# Altium schematic sheet FPGA_MISC.SchDoc: Phaser
size 420 x 297 mm; EDA_Number: ARTIQ; Projet: ARTIQ/SINARA; Author: G.Kasprowicz; CompanyName: WUT ISE; DrawnBy: G.Kasprowicz; Organization: WUT ISE; Address1: PW ISE; Address2: Nowowiejska 15/19 00-665 Warsaw; Address3: gkasprow@gmail.com; Revision: 2; SheetNumber: -; SheetTotal: -; ModifiedBy: -; CheckedDate: -; Title2: xxx; DivGrp: WUT ISE; Designer: G.Kasprowicz; ModifiedDate: -; ProjectName: Sensor Box
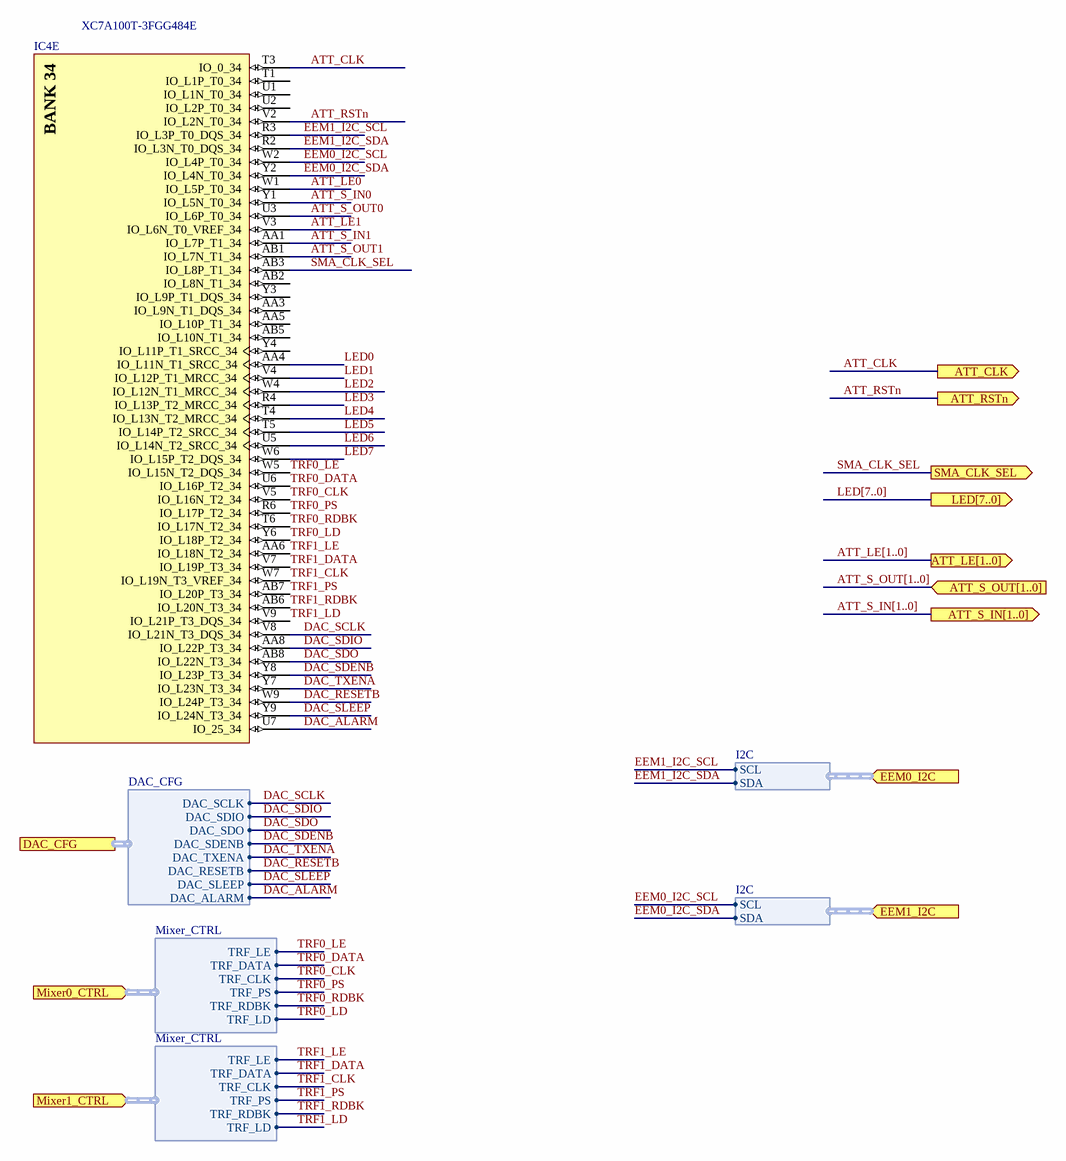
[diagram p0: FPGA_MISC.SchDoc]

## Parts
IC4  XC7A100T-3FGG484E  [FGG484]  (part E of 10)

## Ports
ATT_CLK (out), ATT_LE[1..0] (out), ATT_RSTn (out), ATT_S_IN[1..0] (out), ATT_S_OUT[1..0] (in), DAC_CFG (harness DAC_CFG), EEM0_I2C (in, harness I2C), EEM1_I2C (in, harness I2C), LED[7..0] (out), Mixer0_CTRL (in, harness Mixer_CTRL), Mixer1_CTRL (in, harness Mixer_CTRL), SMA_CLK_SEL (out)

## Harnesses
I2C: SDA, SCL
DAC_CFG: DAC_SCLK, DAC_SDIO, DAC_SDO, DAC_SDENB, DAC_TXENA, DAC_RESETB, DAC_SLEEP, DAC_ALARM
Mixer_CTRL: TRF_LE, TRF_DATA, TRF_CLK, TRF_PS, TRF_RDBK, TRF_LD

## Nets
ATT_CLK: IC4.T3(IO_0_34) ; port ATT_CLK
ATT_LE0: IC4.W1(IO_L5P_T0_34)
ATT_LE1: IC4.V3(IO_L6N_T0_VREF_34)
ATT_RSTn: IC4.V2(IO_L2N_T0_34) ; port ATT_RSTn
ATT_S_IN0: IC4.Y1(IO_L5N_T0_34)
ATT_S_IN1: IC4.AA1(IO_L7P_T1_34)
ATT_S_OUT0: IC4.U3(IO_L6P_T0_34)
ATT_S_OUT1: IC4.AB1(IO_L7N_T1_34)
DAC_ALARM: IC4.U7(IO_25_34) ; port DAC_CFG.DAC_ALARM
DAC_RESETB: IC4.W9(IO_L24P_T3_34) ; port DAC_CFG.DAC_RESETB
DAC_SCLK: IC4.V8(IO_L21N_T3_DQS_34) ; port DAC_CFG.DAC_SCLK
DAC_SDENB: IC4.Y8(IO_L23P_T3_34) ; port DAC_CFG.DAC_SDENB
DAC_SDIO: IC4.AA8(IO_L22P_T3_34) ; port DAC_CFG.DAC_SDIO
DAC_SDO: IC4.AB8(IO_L22N_T3_34) ; port DAC_CFG.DAC_SDO
DAC_SLEEP: IC4.Y9(IO_L24N_T3_34) ; port DAC_CFG.DAC_SLEEP
DAC_TXENA: IC4.Y7(IO_L23N_T3_34) ; port DAC_CFG.DAC_TXENA
EEM0_I2C_SCL: IC4.W2(IO_L4P_T0_34) ; port EEM1_I2C.SCL
EEM0_I2C_SDA: IC4.Y2(IO_L4N_T0_34) ; port EEM1_I2C.SDA
EEM1_I2C_SCL: IC4.R3(IO_L3P_T0_DQS_34) ; port EEM0_I2C.SCL
EEM1_I2C_SDA: IC4.R2(IO_L3N_T0_DQS_34) ; port EEM0_I2C.SDA
LED0: IC4.AA4(IO_L11N_T1_SRCC_34)
LED1: IC4.V4(IO_L12P_T1_MRCC_34)
LED2: IC4.W4(IO_L12N_T1_MRCC_34)
LED3: IC4.R4(IO_L13P_T2_MRCC_34)
LED4: IC4.T4(IO_L13N_T2_MRCC_34)
LED5: IC4.T5(IO_L14P_T2_SRCC_34)
LED6: IC4.U5(IO_L14N_T2_SRCC_34)
LED7: IC4.W6(IO_L15P_T2_DQS_34)
SMA_CLK_SEL: IC4.AB3(IO_L8P_T1_34) ; port SMA_CLK_SEL
TRF0_CLK: IC4.V5(IO_L16N_T2_34) ; port Mixer0_CTRL.TRF_CLK
TRF0_DATA: IC4.U6(IO_L16P_T2_34) ; port Mixer0_CTRL.TRF_DATA
TRF0_LD: IC4.Y6(IO_L18P_T2_34) ; port Mixer0_CTRL.TRF_LD
TRF0_LE: IC4.W5(IO_L15N_T2_DQS_34) ; port Mixer0_CTRL.TRF_LE
TRF0_PS: IC4.R6(IO_L17P_T2_34) ; port Mixer0_CTRL.TRF_PS
TRF0_RDBK: IC4.T6(IO_L17N_T2_34) ; port Mixer0_CTRL.TRF_RDBK
TRF1_CLK: IC4.W7(IO_L19N_T3_VREF_34) ; port Mixer1_CTRL.TRF_CLK
TRF1_DATA: IC4.V7(IO_L19P_T3_34) ; port Mixer1_CTRL.TRF_DATA
TRF1_LD: IC4.V9(IO_L21P_T3_DQS_34) ; port Mixer1_CTRL.TRF_LD
TRF1_LE: IC4.AA6(IO_L18N_T2_34) ; port Mixer1_CTRL.TRF_LE
TRF1_PS: IC4.AB7(IO_L20P_T3_34) ; port Mixer1_CTRL.TRF_PS
TRF1_RDBK: IC4.AB6(IO_L20N_T3_34) ; port Mixer1_CTRL.TRF_RDBK

Not connected (* = marked no-connect by the designer): IC4 AA3(IO_L9N_T1_DQS_34) AA5(IO_L10P_T1_34) AB2(IO_L8N_T1_34) AB5(IO_L10N_T1_34) T1(IO_L1P_T0_34) U1(IO_L1N_T0_34) U2(IO_L2P_T0_34) Y3(IO_L9P_T1_DQS_34) Y4(IO_L11P_T1_SRCC_34)

## Buses and harness runs
bus ATT_LE[1..0] = port ATT_LE[1..0]
bus ATT_S_IN[1..0] = port ATT_S_IN[1..0]
bus ATT_S_OUT[1..0] = port ATT_S_OUT[1..0]
bus LED[7..0] = port LED[7..0]

## Notes on the sheet
- Project/Equipment
- Document
- Designer
- Drawn by
- Check.by
- Copyright WUT ISE 2018.
  This documentation describes Open Hardware and is licensed under the CERN OHL v.1.1. You may redistribute and modify this documentation under the terms of the CERN OHL v.1.1. (http://ohwr.org/CERNOHL). This documentation is distributed WITHOUT ANY EXPRESS OR IMPLIED WARRANTY, INCLUDING OF MERCHANTABILITY, SATISFACTORY QUALITY AND FITNESS FOR A PARTICULAR PURPOSE. Please see the CERN OHL v.1.1 for applicable conditions.
- Contact
- File
- Last Mod.
- Print Date
- Sheet
- Size
- A3
- of
- Rev
- (in symbol CMP-0364-00028-3, part E) BANK 34

## Library data of the parts
IC4 = CMP-0364-00028-3: Artix-7 FPGA, 285 User I/Os, 4 GTP, 484-Ball BGA, Speed Grade 3, Extended Grade, Pb-Free; Manufacturer: Xilinx; Max User I/O: 300; Clock Mgmt Tiles (CMTs): 6; Logic Cells: 101440; Block RAM Blocks (36Kb): 135; Block RAM Blocks (18Kb): 270; Speed Grade: -3; CLBs (Slices): 15850; Block RAM Blocks (Max Kb): 4860; DSP48E1 Slices: 240; RoHS: Pb-Free; ComponentLink3URL: http://www.xilinx.com/support/documentation/data_sheets/ds181_Artix_7_Data_Sheet.pdf; NexusDeviceID: XC7A100T-3FGG484E; DatasheetVersion: v1.12; Mounting Technology: Surface Mount; PackageDescription: Wire-Bond Fine-Pitch BGA, Body 23 x 23 mm, 1.0 mm Pitch; PackageReference: FGG484; ComponentLink2Description: Package Specification; Code_JEDEC: MS-034-AAJ-1; ComponentLink2URL: http://www.xilinx.com/support/documentation/user_guides/ug475_7Series_Pkg_Pinout.pdf; ComponentLink3Description: DC and Switching Characteristics; Generic Part Number: XC7A100T; ComponentLink4Description: Package File; ComponentLink4URL: http://www.xilinx.com/support/packagefiles/a7packages/xc7a100tfgg484pkg.txt; ComponentLink1URL: http://www.xilinx.com/support/documentation/data_sheets/ds180_7Series_Overview.pdf; PartNumber: XC7A100T-3FGG484E; ComponentLink5URL: http://www.xilinx.com/support/documentation/user_guides/ug475_7Series_Pkg_Pinout.pdf; PackageVersion: Rev 1.8; ComponentLink5Description: Packaging and Pinout; ComponentLink1Description: Datasheet; CLBs (Max Distributed RAM Kb): 1188